# Altium schematic sheet RPL_POWER_24V_REV2.SchDoc
size A
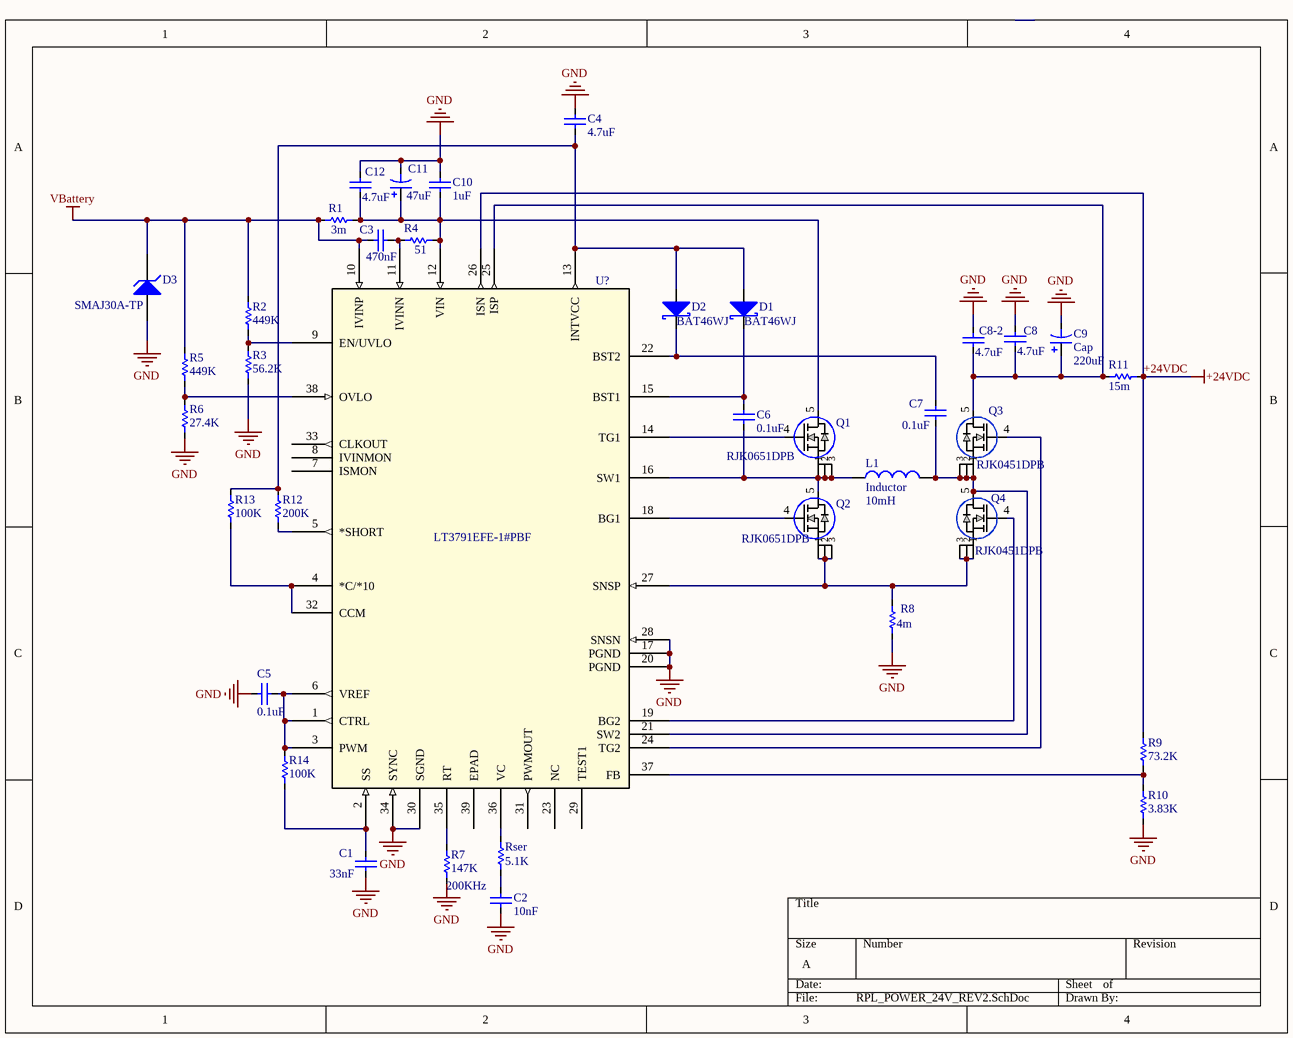
[diagram p0: RPL_POWER_24V_REV2.SchDoc]

## Parts
C1  value 33nF  [C1206C475K5PACTU]  (hidden comment: Cap)
C2  value 10nF  [GRM033R60G474ME90E]  (hidden comment: Rser=5.1K)
C3  value 470nF  [CAPC1005X55N]  (hidden comment: Cap)
C4  value 4.7uF  [C0805C475K9RACAUTO]  (hidden comment: Cap)
C5  value 0.1uF  [C0402T104K4RACTU]  (hidden comment: Cap)
C6  value 0.1uF  [CC0402KRX7R7BB104]  (hidden comment: Cap)
C7  value 0.1uF  [CC0402KRX7R7BB104]  (hidden comment: Cap)
C8  value 4.7uF  [C1206C475K5PACTU]  (hidden comment: Cap)
C8-2  value 4.7uF  [C1206C475K5PACTU]  (hidden comment: Cap)
C9  Cap  value 220uF  [CAPAE430X550N]
C10  value 1uF  [C0805C475K9RACAUTO]  (hidden comment: Cap)
C11  value 47uF  [CAPAE430X550N]  (hidden comment: Cap)
C12  value 4.7uF  [GRJ32DC72A475KE11L]  (hidden comment: Cap)
D1  BAT46WJ  [SODFL250X80-2N]
D2  BAT46WJ  [SODFL250X80-2N]
D3  SMAJ30A-TP  [SMAJ30A-TP]
L1  Inductor  value 10mH  [SER1360-103KLB]
Q1  RJK0651DPB  [LFPAK]
Q2  RJK0651DPB  [LFPAK]
Q3  RJK0451DPB  [LFPAK]
Q4  RJK0451DPB  [LFPAK]
R1  value 3m  [WSL12063L000FEA(1206)]  (hidden comment: Res)
R2  value 449K  [PTN1206E4993BBT1(1206)]  (hidden comment: Res)
R3  value 56.2K  [RN731ETTP5622B25(0402)]  (hidden comment: Res)
R4  value 51  [ERA-2AEB510X(0402)]  (hidden comment: Res)
R5  value 449K  [PTN1206E4993BBT1(1206)]  (hidden comment: Res)
R6  value 27.4K  [PFC-W0603LF-03-2742-B(0603)]  (hidden comment: Res)
R7  200KHz  value 147K  [RT0603BRD07147KL(0603)]
R8  value 4m  [CRE2512-FZ-R004E-3(2512)]  (hidden comment: Res)
R9  value 73.2K  [0603]  (hidden comment: Res)
R10  value 3.83K  [RT0603DRE073K83L(0603)]  (hidden comment: Res)
R11  value 15m  [WSL2010R0150FEA(2010)]  (hidden comment: Res)
R12  value 200K  [ERJ-2RKF2003X(0402)]  (hidden comment: Res)
R13  value 100K  [ERA-2AEB104X(0402)]  (hidden comment: Res)
R14  value 100K  [ERA-2AEB104X(0402)]  (hidden comment: Res)
Rser  value 5.1K  [RC0603FR-075K1L(0603)]  (hidden comment: Res)
U?  LT3791EFE-1#PBF  [TSSOP-38_FE/AA]

## Nets
+24VDC: R9.2 R11.2 U?.26(ISN)
GND: C1.1 C2.1 C4.2 C5.1 C8.2 C8-2.2 C9.2 C10.2 C11.2 C12.2 D3.1(A) R3.1 R6.1 R7.1 R8.1 R10.1 U?.17(PGND) U?.20(PGND) U?.28(SNSN) U?.30(SGND) U?.34(SYNC)
VBattery: C3.1 D3.2(K) R1.1 R2.2 R5.2 U?.10(IVINP)
NetC1_2: C1.2 R14.1 U?.2(SS)
NetC2_2: C2.2 Rser.1
NetC3_2: C3.2 R4.1 U?.11(IVINN)
NetC4_1: C4.1 D1.1(A) D2.1(A) R12.2 R13.2 U?.13(INTVCC)
NetC5_2: C5.2 R14.2 U?.1(CTRL) U?.3(PWM) U?.6(VREF)
NetC6_1: C6.1 L1.1 Q1.1 Q1.2 Q1.3 Q2.5 U?.16(SW1)
NetC6_2: C6.2 D1.3(K) U?.15(BST1)
NetC7_1: C7.1 L1.2 Q3.1 Q3.2 Q3.3 Q4.5 U?.21(SW2)
NetC7_2: C7.2 D2.3(K) U?.22(BST2)
NetC8_1: C8.1 C8-2.1 C9.1 Q3.5 R11.1 U?.25(ISP)
NetC10_1: C10.1 C11.1 C12.1 Q1.5 R1.2 R4.2 U?.12(VIN)
NetQ1_4: Q1.4 U?.14(TG1)
NetQ2_1: Q2.1 Q2.2 Q2.3 Q4.1 Q4.2 Q4.3 R8.2 U?.27(SNSP)
NetQ2_4: Q2.4 U?.18(BG1)
NetQ3_4: Q3.4 U?.24(TG2)
NetQ4_4: Q4.4 U?.19(BG2)
NetR2_1: R2.1 R3.2 U?.9(EN/UVLO)
NetR5_1: R5.1 R6.2 U?.38(OVLO)
NetR7_2: R7.2 U?.35(RT)
NetR9_1: R9.1 R10.2 U?.37(FB)
NetR12_1: R12.1 U?.5(*SHORT)
NetR13_1: R13.1 U?.4(*C/*10) U?.32(CCM)
NetRser_2: Rser.2 U?.36(VC)

Not connected (* = marked no-connect by the designer): U? 7(ISMON) 8(IVINMON) 23(NC) 29(TEST1) 31(PWMOUT) 33(CLKOUT) 39(EPAD)

## Library data of the parts
C2 = Cap
C9 C11 = Cap Elec
D1 D2 = Diod
D3 = D Zener: ESD Suppressors / TVS Diodes 30V 400 Watts
Q1 Q2 = RJK0651DPB-00#J5: Imported; Vendor: Renesas; VDSS_(V): 60; VGSS_(V): +/-20; ID_(A)@25C: 25; Pch(W): 45; Rds(on)@VGS: 10V,[8.0V]Max=14; QGD_(nC): 3.7; QG_(nC): 15; RG_(?): 0.7; Manufacturer_Part_Number: RJK0651DPB-00#J5; DatasheetLink: http://www.renesas.com/request?SCREEN_ID=ViewDocumentSearch&EXECUTE_ACTION=search&KEY_WORD=RJK0651DPB-00#J5; PartType: MOSFET MV; Package: LFPAK; Manufacturer_Name: Renesas; Value: Value
Q3 Q4 = RJK0451DPB-00#J5: Imported; Vendor: Renesas; VDSS_(V): 40; VGSS_(V): +/-20; ID_(A)@25C: 35; Pch(W): 45; Rds(on)@VGS: 10V,[8.0V]Max=7; QGD_(nC): 3; QG_(nC): 14; RG_(?): 0.7; Manufacturer_Part_Number: RJK0451DPB-00#J5; DatasheetLink: http://www.renesas.com/request?SCREEN_ID=ViewDocumentSearch&EXECUTE_ACTION=search&KEY_WORD=RJK0451DPB-00#J5; PartType: MOSFET MV; Package: LFPAK; Manufacturer_Name: Renesas; Value: Value
R7 = Res
U? = LT3791EFE-1#PBF: Imported; Vendor: Linear Technology; Manufacturer_Part_Number: lt3791efe-1#pbf; Value: Value; Type: Type; RefDes: RefDes